# Altium schematic sheet hdmi.SchDoc
size A4; SheetNumber: 11; SheetTotal: 21
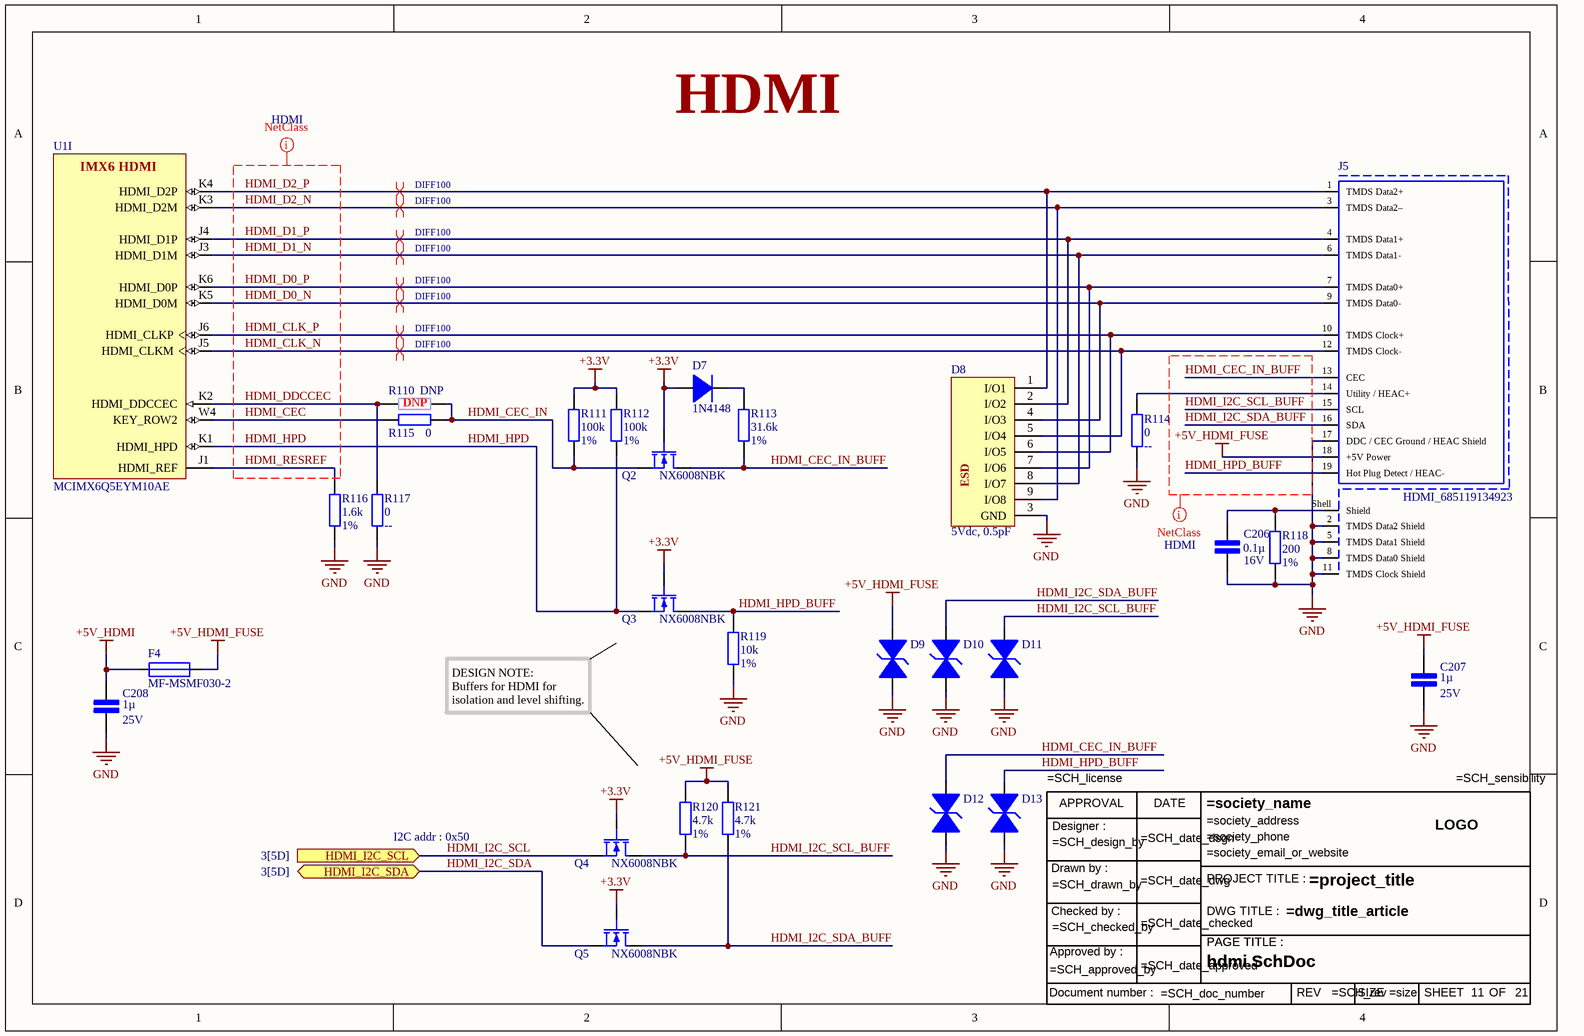
[diagram p0: hdmi.SchDoc]

## Parts
C206  0.1µ  Tension du diélectrique: 16V  [Cap cer 0402/1005]
C207  1µ  Tension du diélectrique: 25V  [Cap cer 0402/1005]
C208  1µ  Tension du diélectrique: 25V  [Cap cer 0402/1005]
D7  1N4148  [diode SOD-123]
D8  5Vdc, 0.5pF  [TVS 8 pin]
D9  TVS 5V  [inductor 0402/1005]  (value not drawn)
D10  TVS 5V  [inductor 0402/1005]  (value not drawn)
D11  TVS 5V  [inductor 0402/1005]  (value not drawn)
D12  TVS 5V  [inductor 0402/1005]  (value not drawn)
D13  TVS 5V  [inductor 0402/1005]  (value not drawn)
F4  MF-MSMF030-2  [Fuse 1812/4532 MF-MSMF050-2]
J5  HDMI_685119134923  [HDMI_685119134923]
Q2  NX6008NBK  [Sot-23-3 mosfet]
Q3  NX6008NBK  [Sot-23-3 mosfet]
Q4  NX6008NBK  [Sot-23-3 mosfet]
Q5  NX6008NBK  [Sot-23-3 mosfet]
R110  DNP  [Res 0603/1603]
R111  100k  pourcentage: 1%  [Res 0402/1005]
R112  100k  pourcentage: 1%  [Res 0402/1005]
R113  31.6k  pourcentage: 1%  [Res 0402/1005]
R114  0  [Res 0402/1005]
R115  0  [Res 0603/1603]
R116  1.6k  pourcentage: 1%  [Res 0402/1005]
R117  0  [Res 0603/1603]
R118  200  pourcentage: 1%  [Res 0402/1005]
R119  10k  pourcentage: 1%  [Res 0402/1005]
R120  4.7k  pourcentage: 1%  [Res 0402/1005]
R121  4.7k  pourcentage: 1%  [Res 0402/1005]
TB10  Title bloc ANSI modified  (value not drawn)
U1  MCIMX6Q5EYM10AE  [FRES-2197-01]  (part I of 21)

## Ports
HDMI_I2C_SCL (in, see 3[5D]), HDMI_I2C_SDA (bidir, see 3[5D])

## Nets
+3.3V: D7.A Q2.G Q3.G Q4.G Q5.G R111.2 R112.2
+5V_HDMI: C208.1 F4.1
+5V_HDMI_FUSE: C207.1 D9.1 F4.2 J5.18(+5V_Power) R120.2 R121.2
GND: C206.2 C207.2 C208.2 D8.3(GND) D9.2 D10.2 D11.2 D12.2 D13.2 J5.2(TMDS_Data2_Shield) J5.5(TMDS_Data1_Shield) J5.8(TMDS_Data0_Shield) J5.11(TMDS_Clock_Shield) J5.17(DDC_/_CEC_Ground_/_HEAC_Shield) R114.1 R116.1 R117.1 R118.1 R119.1
HDMI_CEC: R115.1 U1.W4(KEY_ROW2)
HDMI_CEC_IN: Q2.S R110.2 R111.1 R115.2
HDMI_CEC_IN_BUFF: D12.1 J5.13(CEC) Q2.D R113.1
HDMI_CLK_N: D8.5(I/O4) J5.12(TMDS_Clock-) U1.J5(HDMI_CLKM)
HDMI_CLK_P: D8.6(I/O5) J5.10(TMDS_Clock+) U1.J6(HDMI_CLKP)
HDMI_D0_N: D8.4(I/O3) J5.9(TMDS_Data0-) U1.K5(HDMI_D0M)
HDMI_D0_P: D8.7(I/O6) J5.7(TMDS_Data0+) U1.K6(HDMI_D0P)
HDMI_D1_N: D8.8(I/O7) J5.6(TMDS_Data1-) U1.J3(HDMI_D1M)
HDMI_D1_P: D8.2(I/O2) J5.4(TMDS_Data1+) U1.J4(HDMI_D1P)
HDMI_D2_N: D8.9(I/O8) J5.3(TMDS_Data2–) U1.K3(HDMI_D2M)
HDMI_D2_P: D8.1(I/O1) J5.1(TMDS_Data2+) U1.K4(HDMI_D2P)
HDMI_DDCCEC: R110.1 R117.2 U1.K2(HDMI_DDCCEC)
HDMI_HPD: Q3.S R112.1 U1.K1(HDMI_HPD)
HDMI_HPD_BUFF: D13.1 J5.19(Hot_Plug_Detect_/_HEAC-) Q3.D R119.2
HDMI_I2C_SCL: Q4.S ; port HDMI_I2C_SCL
HDMI_I2C_SCL_BUFF: D11.1 J5.15(SCL) Q4.D R120.1
HDMI_I2C_SDA: Q5.S ; port HDMI_I2C_SDA
HDMI_I2C_SDA_BUFF: D10.1 J5.16(SDA) Q5.D R121.1
HDMI_RESREF: R116.2 U1.J1(HDMI_REF)
NetC206_1: C206.1 J5.Shell(Shield) R118.2
NetD7_K: D7.K R113.2
NetJ5_14: J5.14(Utility_/_HEAC+) R114.2

## Layout directives
net class HDMI: +5V_HDMI_FUSE, HDMI_CEC, HDMI_CEC_IN_BUFF, HDMI_CLK_N, HDMI_CLK_P, HDMI_D0_N, HDMI_D0_P, HDMI_D1_N, HDMI_D1_P, HDMI_D2_N, HDMI_D2_P, HDMI_DDCCEC, HDMI_HPD, HDMI_HPD_BUFF, HDMI_I2C_SCL_BUFF, HDMI_I2C_SDA_BUFF, HDMI_RESREF
differential pair; differential pair class DIFF100: HDMI_CLK_N, HDMI_CLK_P, HDMI_D0_N, HDMI_D0_P, HDMI_D1_N, HDMI_D1_P, HDMI_D2_N, HDMI_D2_P

## Notes on the sheet
- HDMI
- DESIGN NOTE:
  Buffers for HDMI for isolation and level shifting.
- I2C addr : 0x50
- (in symbol IMX6Q5EYM10AE, part I) IMX6 HDMI
- (in symbol Title bloc ANSI) APPROVAL; DATE; Designer :; LOGO; Drawn by :; PROJECT TITLE :; Checked by :; DWG TITLE :; PAGE TITLE :; Approved by :; Document number :; REV; SIZE; SHEET; OF
- (in symbol TVS HDMI) ESD

## Library data of the parts
C206 = cap 0.1µ 16V: cap solid electrolyte 0.1µ 6.3V 10%; Diélectrique: X7R
C207 C208 = cap 1µ 25V: cap cer 1µ 25V 10% X5R 0402; Diélectrique: X5R
D7 = Diode 1N4148 100V 150mA
D8 = TVS HDMI: WE-TVS TVS Diode – Super Speed Series, DFN3810-9L, 8 Channel, 5Vdc, 0.5pF 824014885; Manufacturer: Wurth Elektronik; Reverse Peak Pulse Current: 5A; Channel ESD Clamping Voltage: 10.5V; Channel Number: 8; Channel Operating Voltage: 5V; Channel Reverse Leakage Current: 1uA; ESD Air Discharge Capability: 15kV; Polarity: Unidirectional; Reverse Breakdown Voltage: 6V; ComponentLink1Description: Manufacturer Link; ComponentLink1URL: http://www.we-online.de; ComponentLink2Description: Datasheet; ComponentLink2URL: https://www.we-online.com/catalog/datasheet/824014885.pdf; Manufacturer Part Number: 824014885; Size: DFN3810-9L; Mounting Technology: SMT; Packaging: Tape and Reel; Channel Input Capacitance: 0.5pF; ESD Contact Discharge Capability: 15kV; Height: 0.5mm; Length: 3.8mm; Operating Temperature max.: 85C; Operating Temperature min.: -55C; Width: 1mm
D9-D13 = TVS suppressor 82357120050: 82357120050; ComponentLink1Description: New link; ComponentLink1URL: https://www.we-online.com/catalog/datasheet/82357120050.pdf
F4 = Fuse PPTC 0.3A: Hold : 0.3A, trip 0.6A 30V 1812
Q2-Q5 = Tr nmos NX6008NBK: SOT-23-3 270mA 60V ESD protected 2kV HBM
R110 = res DNP 0603: pourcentage: 1%
R111 R112 = res 100k 1%: res 100k 1% 0402
R113 = res 31.6k 1%: res 31.6k 1% 0402
R114 = res 0Ohm small: res 0402; pourcentage: --
R115 R117 = res 0Ohm: res 0603; pourcentage: --
R116 = res 1.6k 1%: res 1.6k 1% 0402
R118 = res 200 1%: res 200 1% 0402
R119 = res 10k 1%: res 10k 1% 0402
R120 R121 = res 4.7k 1%: res 4.7k 1% 0402
TB10 = Title bloc ANSI
U1 = IMX6Q5EYM10AE: 32-Bit i.MX 6 Quad Application Processor, 1 GHz, 256 KB RAM, Extended Consumer Grade, 624-Pin FCPBGA, RoHS, Tape and Reel; PartNumber: MCIMX6Q5EYM10ACR; Manufacturer: Freescale Semiconductor; CAN: FlexCAN; Number of Cores: 4 Spec; External Memory Supported: DDR3, DDR3L, FLASH, LPDDR2; Speed Grade: 1 GHz; Core Type: ARM Cortex A9; Cache (KB): 32; Ethernet: 1 Gbps + IEEE 1588; Internal RAM (KB): 256; ComponentLink1Description: Manufacturer URL; ComponentLink2Description: Datasheet; DatasheetVersion: Rev. 2.3; ComponentLink3URL: http://cache.freescale.com/files/32bit/doc/data_sheet/IMX6DQCEC.pdf?fpsp=1&WT_TYPE=Data%20Sheets&WT_VENDOR=FREESCALE&WT_FILE_FORMAT=pdf&WT_ASSET=Documentation; ComponentLink1URL: http://www.freescale.com/; Packing: Tape and Reel; Temperature Range: -20 to 105 degC; ComponentLink2URL: http://cache.freescale.com/files/32bit/doc/data_sheet/IMX6DQCEC.pdf?fpsp=1&WT_TYPE=Data%20Sheets&WT_VENDOR=FREESCALE&WT_FILE_FORMAT=pdf&WT_ASSET=Documentation; ComponentLink3Description: Package Specification; PackageVersion: Rev. A; RoHS: TRUE; Quad/Dual CPU: i.MX 6Quad; Mounting Technology: Surface Mount; PackageReference: FCPBGA-624; PackageDescription: 624-pin Ball Grid Array Package, Body 21 x 21mm, Pitch 0.8mm